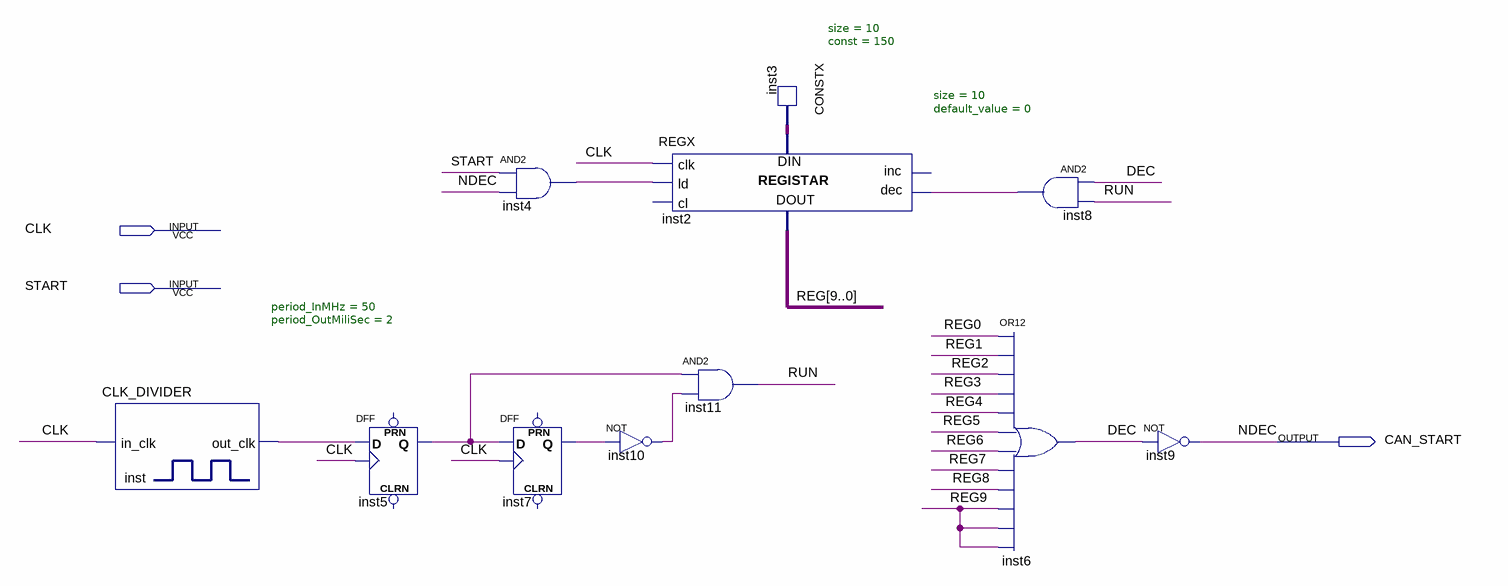
[diagram p0: schematic sheet]
// Quartus schematic Time.bdf as structural Verilog: 11 symbols, 3 pins
module Time (
  input  CLK,
  input  START,
  output CAN_START
);

  wire DEC, inst4_out, inst5_q, inst7_q, inst8_out, inst10_out, inst_out_clk, RUN;
  wire [9:0] inst3_data, REG;

  CLK_DIVIDER #(.period_InMHz(50), .period_OutMiliSec(2)) inst (.in_clk(CLK), .out_clk(inst_out_clk));
  DFF inst5 (.CLK(CLK), .D(inst_out_clk), .Q(inst5_q));  // open: CLRN, PRN
  and inst4 (inst4_out, START, CAN_START);
  DFF inst7 (.CLK(CLK), .D(inst5_q), .Q(inst7_q));  // open: CLRN, PRN
  not inst10 (inst10_out, inst7_q);
  REGX #(.size(10), .default_value(0)) inst2 (
    .clk(CLK), .ld(inst4_out), .dec(inst8_out), .data_in(inst3_data), .data_out(REG));  // open: cl, inc
  and inst11 (RUN, inst5_q, inst10_out);
  CONSTX #(.size(10), .\const (150)) inst3 (.data(inst3_data));
  and inst8 (inst8_out, DEC, RUN);
  or inst6 (DEC, REG[0], REG[1], REG[2], REG[3], REG[4], REG[5], REG[6], REG[7], REG[8], REG[9], REG[9], REG[9]);
  not inst9 (CAN_START, DEC);

  // Other names for the same wires on the sheet: NDEC = CAN_START
endmodule
